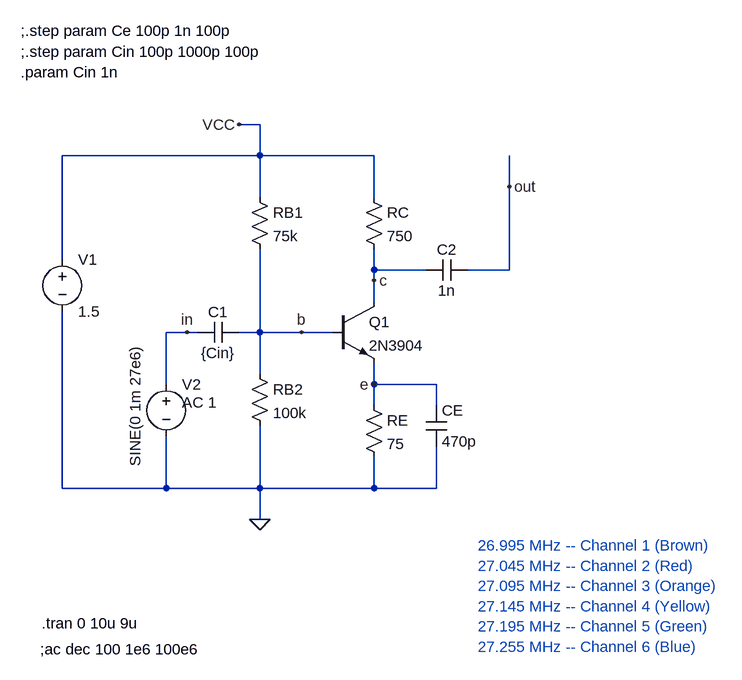
[diagram p0: schematic 01_Bipolar_Biasing.asc]
01_Bipolar_Biasing.asc, the LTspice schematic file:
Version 4
SHEET 1 1044 920
WIRE 304 96 272 96
WIRE 304 144 304 96
WIRE 304 144 0 144
WIRE 480 144 304 144
WIRE 688 192 688 144
WIRE 304 208 304 144
WIRE 480 208 480 144
WIRE 0 304 0 144
WIRE 480 320 480 288
WIRE 560 320 480 320
WIRE 688 320 688 192
WIRE 688 320 624 320
WIRE 480 336 480 320
WIRE 480 368 480 336
WIRE 192 416 160 416
WIRE 208 416 192 416
WIRE 304 416 304 288
WIRE 304 416 272 416
WIRE 368 416 304 416
WIRE 416 416 368 416
WIRE 304 480 304 416
WIRE 160 496 160 416
WIRE 480 496 480 464
WIRE 576 496 480 496
WIRE 480 528 480 496
WIRE 576 528 576 496
WIRE 0 656 0 384
WIRE 160 656 160 576
WIRE 160 656 0 656
WIRE 304 656 304 560
WIRE 304 656 160 656
WIRE 480 656 480 608
WIRE 480 656 304 656
WIRE 576 656 576 592
WIRE 576 656 480 656
WIRE 304 704 304 656
FLAG 480 336 c
FLAG 304 704 0
FLAG 368 416 b
FLAG 272 96 VCC
FLAG 480 496 e
FLAG 688 192 out
FLAG 192 416 in
SYMBOL voltage 0 288 R0
WINDOW 123 0 0 Left 0
WINDOW 39 0 0 Left 0
SYMATTR InstName V1
SYMATTR Value 1.5
SYMBOL res 464 192 R0
SYMATTR InstName RC
SYMATTR Value 750
SYMBOL npn 416 368 R0
SYMATTR InstName Q1
SYMATTR Value 2N3904
SYMBOL res 288 192 R0
SYMATTR InstName RB1
SYMATTR Value 75k
SYMBOL res 464 512 R0
SYMATTR InstName RE
SYMATTR Value 75
SYMBOL cap 560 528 R0
SYMATTR InstName CE
SYMATTR Value 470p
SYMBOL res 288 464 R0
SYMATTR InstName RB2
SYMATTR Value 100k
SYMBOL voltage 160 480 R0
WINDOW 3 -48 -44 VRight 2
WINDOW 123 24 44 Left 2
WINDOW 39 0 0 Left 0
SYMATTR Value SINE(0 1m 27e6)
SYMATTR Value2 AC 1
SYMATTR InstName V2
SYMBOL cap 208 432 R270
WINDOW 0 32 32 VTop 2
WINDOW 3 0 32 VBottom 2
SYMATTR InstName C1
SYMATTR Value {Cin}
SYMBOL cap 624 304 R90
WINDOW 0 0 32 VBottom 2
WINDOW 3 32 32 VTop 2
SYMATTR InstName C2
SYMATTR Value 1n
TEXT -32 864 Left 2 !.tran 0 10u 9u
TEXT 640 744 Left 2 ;26.995 MHz -- Channel 1 (Brown)\n27.045 MHz -- Channel 2 (Red)\n27.095 MHz -- Channel 3 (Orange)\n27.145 MHz -- Channel 4 (Yellow)\n27.195 MHz -- Channel 5 (Green)\n27.255 MHz -- Channel 6 (Blue)
TEXT -34 904 Left 2 !;ac dec 100 1e6 100e6
TEXT -64 -16 Left 2 !;.step param Cin 100p 1000p 100p\n.param Cin 1n
TEXT -64 -48 Left 2 !;.step param Ce 100p 1n 100p

The netlist it stands for:
* 01_Bipolar_Biasing.asc
V1 VCC 0 1.5
RC VCC c 750
Q1 c b e 0 2N3904
RB1 VCC b 75k
RE e 0 75
CE e 0 470p
RB2 b 0 100k
V2 in 0 SINE(0 1m 27e6) AC 1
C1 in b {Cin}
C2 out c 1n
.model NPN NPN
.model PNP PNP
.lib standard.bjt
.tran 0 10u 9u
* 26.995 MHz -- Channel 1 (Brown)
* 27.045 MHz -- Channel 2 (Red)
* 27.095 MHz -- Channel 3 (Orange)
* 27.145 MHz -- Channel 4 (Yellow)
* 27.195 MHz -- Channel 5 (Green)
* 27.255 MHz -- Channel 6 (Blue)
;ac dec 100 1e6 100e6
;.step param Cin 100p 1000p 100p
.param Cin 1n
;.step param Ce 100p 1n 100p
.backanno
.end